# EAGLE schematic ads-b (EAGLE 7.5.0)
PROJECT_NAME: ADS-B Receiver; REVISION: 0.1

## Sheet 1 of 3
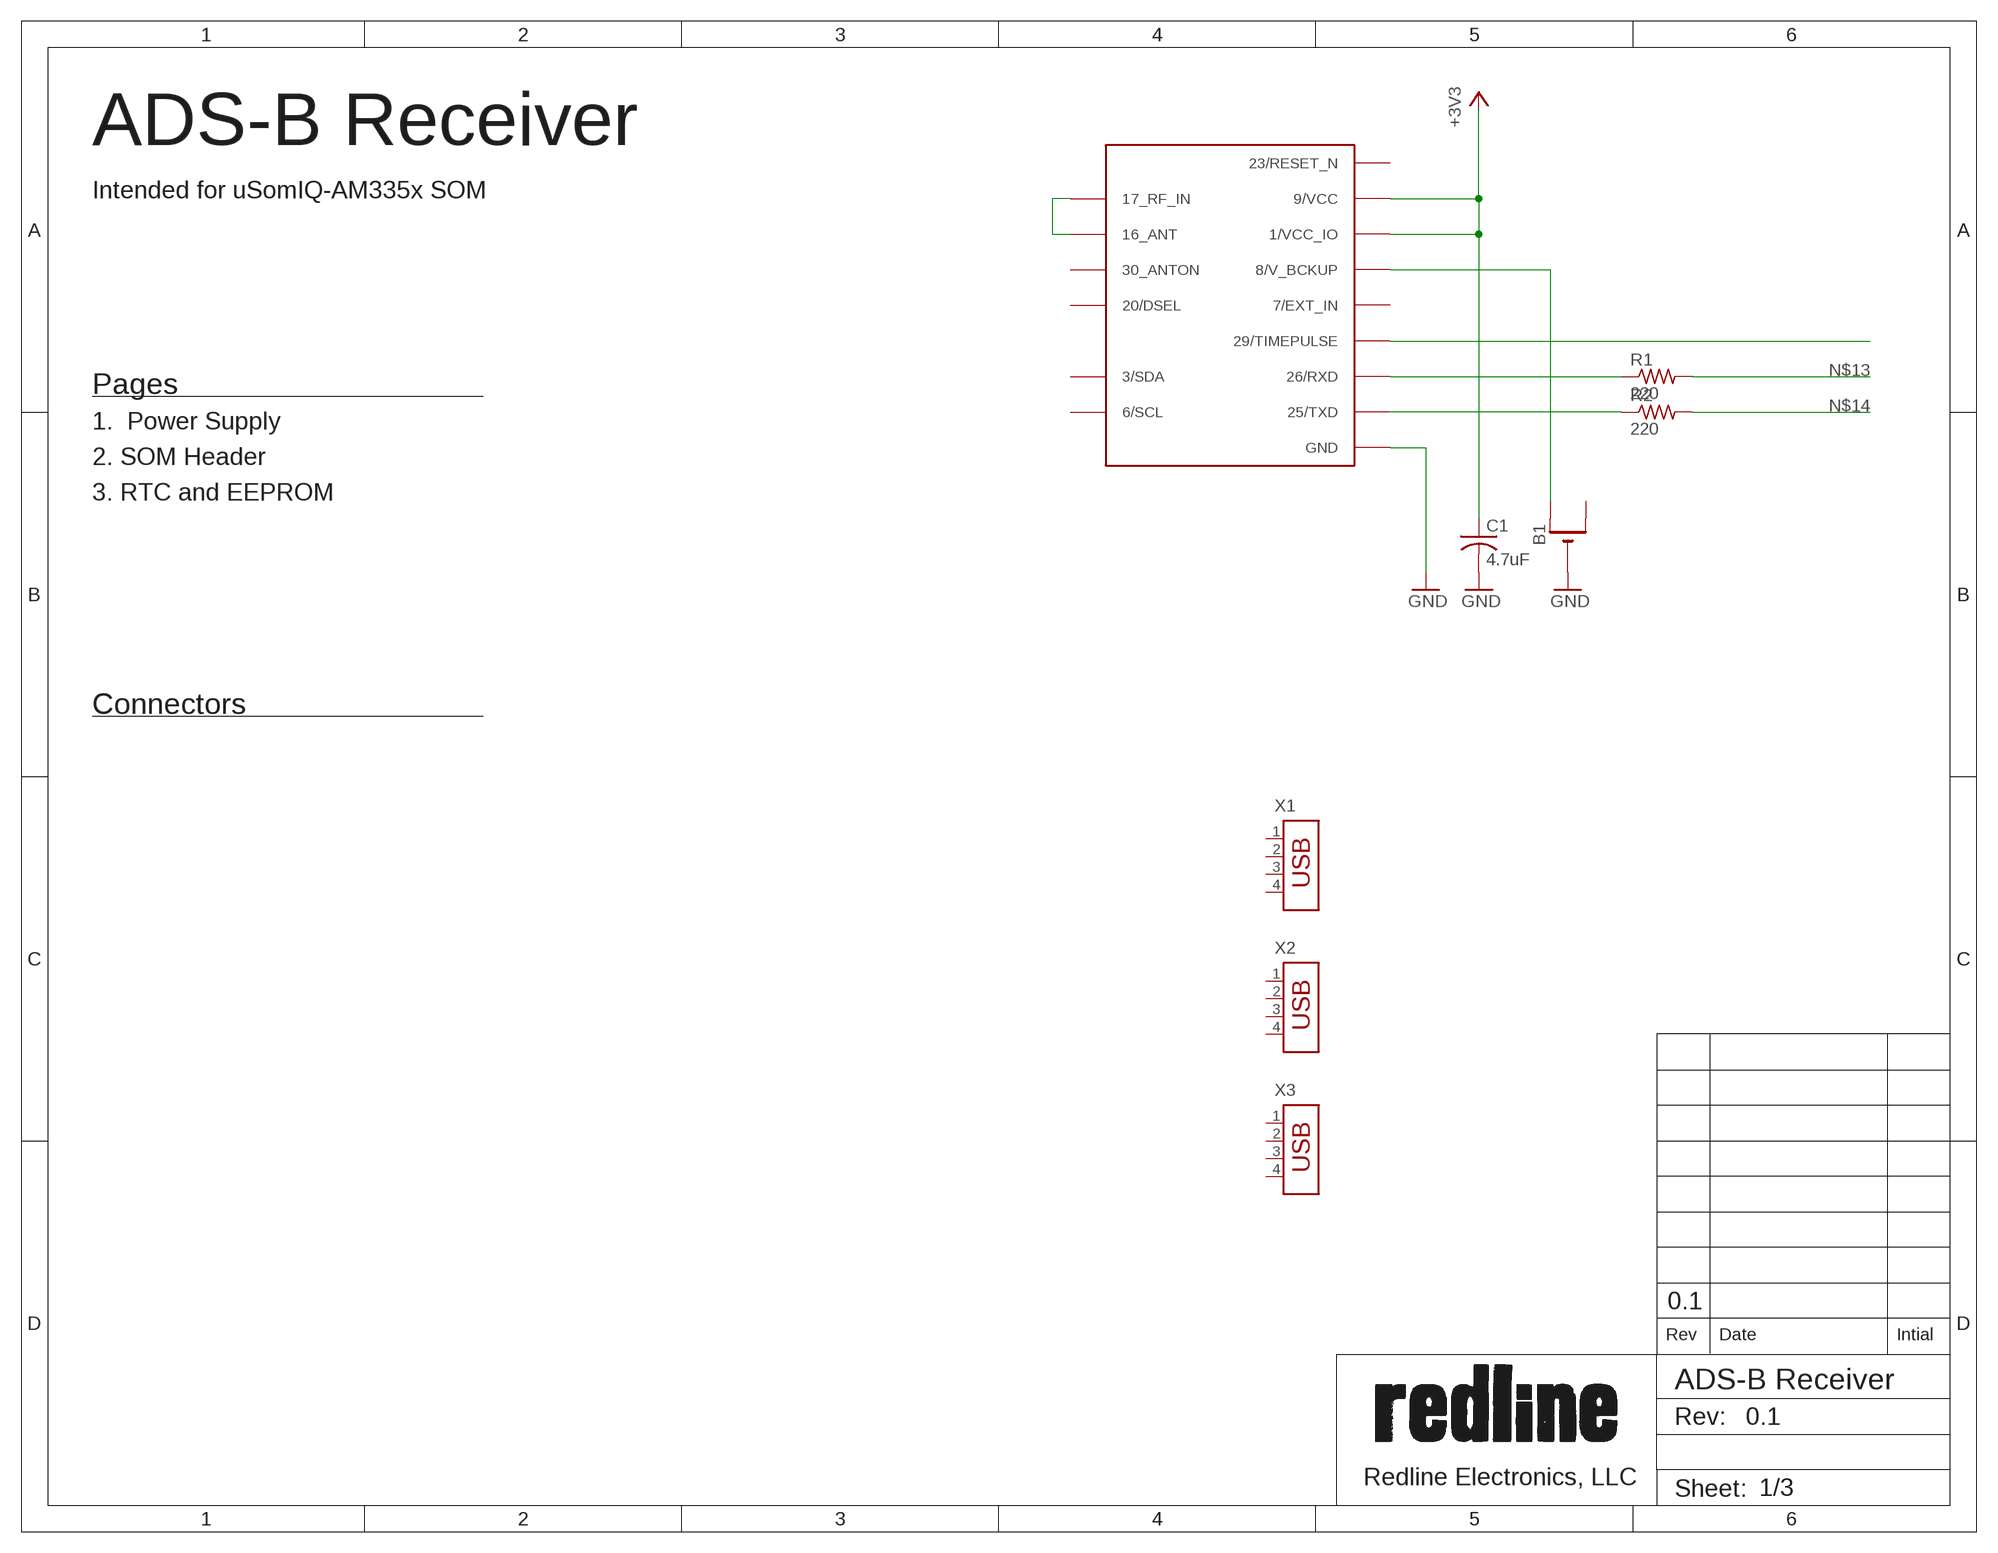
[diagram p0: schematic, sheet 1]

### Parts
B1  CR1220SMT  [CR1220-SMD]
C1  4.7uF  C-USC0603  [C0603]
R1  220  R-US_R0603  [R0603]
R2  220  R-US_R0603  [R0603]
U$1  UBLOX_CAM  [UBLOX_CAM]
X1  USB-787616  [USB]
X2  USB-787616  [USB]
X3  USB-787616  [USB]

### Nets
+3V3: C1.1 U$1.1/VCC_IO U$1.9/VCC ; also sheet 2
GND: B1.- C1.2 U$1.4/GND(GND) U$1.5/GND(GND) U$1.10/GND(GND) U$1.11/GND(GND) U$1.12/GND(GND) U$1.13/GND(GND) U$1.14/GND(GND) U$1.15/GND(GND) U$1.18/GND(GND) U$1.19/GND(GND) U$1.21/GND(GND) U$1.22/GND(GND) U$1.27/GND(GND) U$1.31/GND(GND) ; also sheet 2
N$1: B1.+$1(+) U$1.8/V_BCKP(8/V_BCKUP)
N$8: R1.1 U$1.26/RXD
N$12: R2.1 U$1.25/TXD
N$13: R1.2
N$14: R2.2
N$15: U$1.29/TIMEPULSE
N$26: U$1.16/ANT(16_ANT) U$1.17/RF_IN(17_RF_IN)
Unconnected: B1.+$2(+1) U$1.3/SDA U$1.6/SCL U$1.7/EXINT(7/EXT_IN) U$1.20/DSEL U$1.30/ANTON(30_ANTON) X1.1 X1.2 X1.3 X1.4 X2.1 X2.2 X2.3 X2.4 X3.1 X3.2 X3.3 X3.4

### Notes on the sheet
- ADS-B Receiver
- Intended for uSomIQ-AM335x SOM
- Pages
- 1.  Power Supply
- 2. SOM Header
- 3. RTC and EEPROM
- Connectors
- 0.1

## Sheet 2 of 3
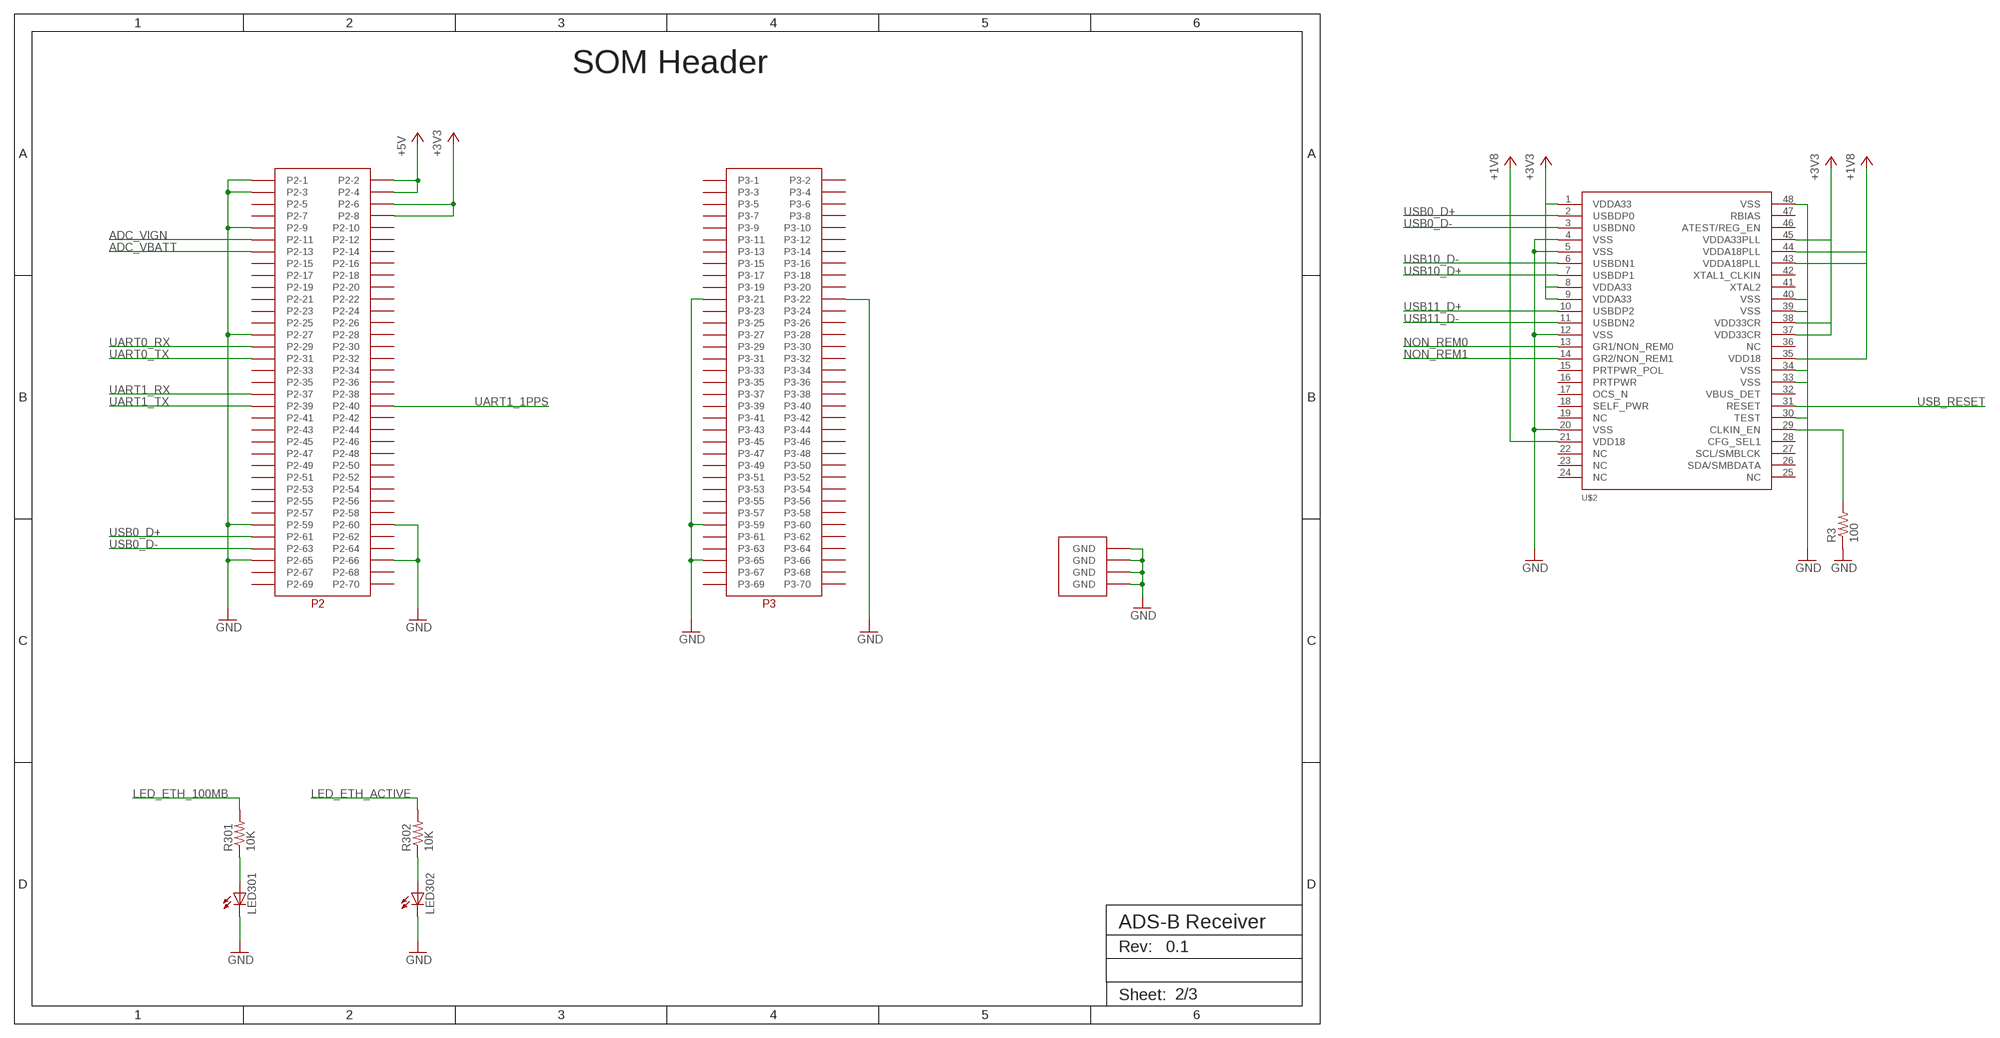
[diagram p1: schematic, sheet 2]

### Parts
LED301  LEDSML0603  [SML0603]
LED302  LEDSML0603  [SML0603]
P301  USOMIQ-AM335X  [USOMIQ-AM335X]
R3  100  R-US_R0603  [R0603]
R301  10K  R-US_R0603  [R0603]
R302  10K  R-US_R0603  [R0603]
U$2  USB2502  [S-PQFP-G48]

### Nets
+3V3: P301.P$6(P2-6) P301.P$8(P2-8) U$2.1(VDDA33) U$2.8(VDDA33) U$2.9(VDDA33) U$2.21(VDD18) U$2.35(VDD18) U$2.37(VDD33CR) U$2.38(VDD33CR) U$2.43(VDDA18PLL) U$2.44(VDDA18PLL) U$2.45(VDDA33PLL) ; supply symbol labelled +1V8 ; also sheet 1
+5V: P301.P$2(P2-2) P301.P$4(P2-4)
ADC_VBATT: P301.P$13(P2-13)
ADC_VIGN: P301.P$11(P2-11)
GND: LED301.C LED302.C P301.MOUNT@0(GND) P301.MOUNT@1(GND) P301.MOUNT@2(GND) P301.MOUNT@3(GND) P301.P$1(P2-1) P301.P$3(P2-3) P301.P$9(P2-9) P301.P$27(P2-27) P301.P$59(P2-59) P301.P$60(P2-60) P301.P$65(P2-65) P301.P$66(P2-66) P301.P$91(P3-21) P301.P$92(P3-22) P301.P$129(P3-59) P301.P$135(P3-65) R3.1 U$2.4(VSS) U$2.5(VSS) U$2.12(VSS) U$2.20(VSS) U$2.30(TEST) U$2.33(VSS) U$2.34(VSS) U$2.39(VSS) U$2.40(VSS) U$2.48(VSS) ; also sheet 1
LED_ETH_100MB: R301.2
LED_ETH_ACTIVE: R302.2
N$2: R3.2 U$2.29(CLKIN_EN)
NON_REM0: U$2.13(GR1/NON_REM0)
NON_REM1: U$2.14(GR2/NON_REM1)
UART0_RX: P301.P$29(P2-29)
UART0_TX: P301.P$31(P2-31)
UART1_1PPS: P301.P$40(P2-40)
UART1_RX: P301.P$37(P2-37)
UART1_TX: P301.P$39(P2-39)
USB0_D+: P301.P$61(P2-61) U$2.2(USBDP0)
USB0_D-: P301.P$63(P2-63) U$2.3(USBDN0)
USB10_D+: U$2.7(USBDP1)
USB10_D-: U$2.6(USBDN1)
USB11_D+: U$2.10(USBDP2)
USB11_D-: U$2.11(USBDN2)
USB_RESET: U$2.31(RESET)
VDD_PGOOD1: LED301.A R301.1
VDD_PGOOD2: LED302.A R302.1
Unconnected: P301.P$5(P2-5) P301.P$7(P2-7) P301.P$10(P2-10) P301.P$12(P2-12) P301.P$14(P2-14) P301.P$15(P2-15) P301.P$16(P2-16) P301.P$17(P2-17) P301.P$18(P2-18) P301.P$19(P2-19) P301.P$20(P2-20) P301.P$21(P2-21) P301.P$22(P2-22) P301.P$23(P2-23) P301.P$24(P2-24) P301.P$25(P2-25) P301.P$26(P2-26) P301.P$28(P2-28) P301.P$30(P2-30) P301.P$32(P2-32) P301.P$33(P2-33) P301.P$34(P2-34) P301.P$35(P2-35) P301.P$36(P2-36) P301.P$38(P2-38) P301.P$41(P2-41) P301.P$42(P2-42) P301.P$43(P2-43) P301.P$44(P2-44) P301.P$45(P2-45) P301.P$46(P2-46) P301.P$47(P2-47) P301.P$48(P2-48) P301.P$49(P2-49) P301.P$50(P2-50) P301.P$51(P2-51) P301.P$52(P2-52) P301.P$53(P2-53) P301.P$54(P2-54) P301.P$55(P2-55) P301.P$56(P2-56) P301.P$57(P2-57) P301.P$58(P2-58) P301.P$62(P2-62) P301.P$64(P2-64) P301.P$67(P2-67) P301.P$68(P2-68) P301.P$69(P2-69) P301.P$70(P2-70) P301.P$71(P3-1) P301.P$72(P3-2) P301.P$73(P3-3) P301.P$74(P3-4) P301.P$75(P3-5) P301.P$76(P3-6) P301.P$77(P3-7) P301.P$78(P3-8) P301.P$79(P3-9) P301.P$80(P3-10) P301.P$81(P3-11) P301.P$82(P3-12) P301.P$83(P3-13) P301.P$84(P3-14) P301.P$85(P3-15) P301.P$86(P3-16) P301.P$87(P3-17) P301.P$88(P3-18) P301.P$89(P3-19) P301.P$90(P3-20) P301.P$93(P3-23) P301.P$94(P3-24) P301.P$95(P3-25) P301.P$96(P3-26) P301.P$97(P3-27) P301.P$98(P3-28) P301.P$99(P3-29) P301.P$100(P3-30) P301.P$101(P3-31) P301.P$102(P3-32) P301.P$103(P3-33) P301.P$104(P3-34) P301.P$105(P3-35) P301.P$106(P3-36) P301.P$107(P3-37) P301.P$108(P3-38) P301.P$109(P3-39) P301.P$110(P3-40) P301.P$111(P3-41) P301.P$112(P3-42) P301.P$113(P3-43) P301.P$114(P3-44) P301.P$115(P3-45) P301.P$116(P3-46) P301.P$117(P3-47) P301.P$118(P3-48) P301.P$119(P3-49) P301.P$120(P3-50) P301.P$121(P3-51) P301.P$122(P3-52) P301.P$123(P3-53) P301.P$124(P3-54) P301.P$125(P3-55) P301.P$126(P3-56) P301.P$127(P3-57) P301.P$128(P3-58) P301.P$130(P3-60) P301.P$131(P3-61) P301.P$132(P3-62) P301.P$133(P3-63) P301.P$134(P3-64) P301.P$136(P3-66) P301.P$137(P3-67) P301.P$138(P3-68) P301.P$139(P3-69) P301.P$140(P3-70) U$2.15(PRTPWR_POL) U$2.16(PRTPWR) U$2.17(OCS_N) U$2.18(SELF_PWR) U$2.19(NC) U$2.22(NC) U$2.23(NC) U$2.24(NC) U$2.25(NC) U$2.26(SDA/SMBDATA) U$2.27(SCL/SMBLCK) U$2.28(CFG_SEL1) U$2.32(VBUS_DET) U$2.36(NC) U$2.41(XTAL2) U$2.42(XTAL1_CLKIN) U$2.46(ATEST/REG_EN) U$2.47(RBIAS)

### Notes on the sheet
- SOM Header

## Sheet 3 of 3
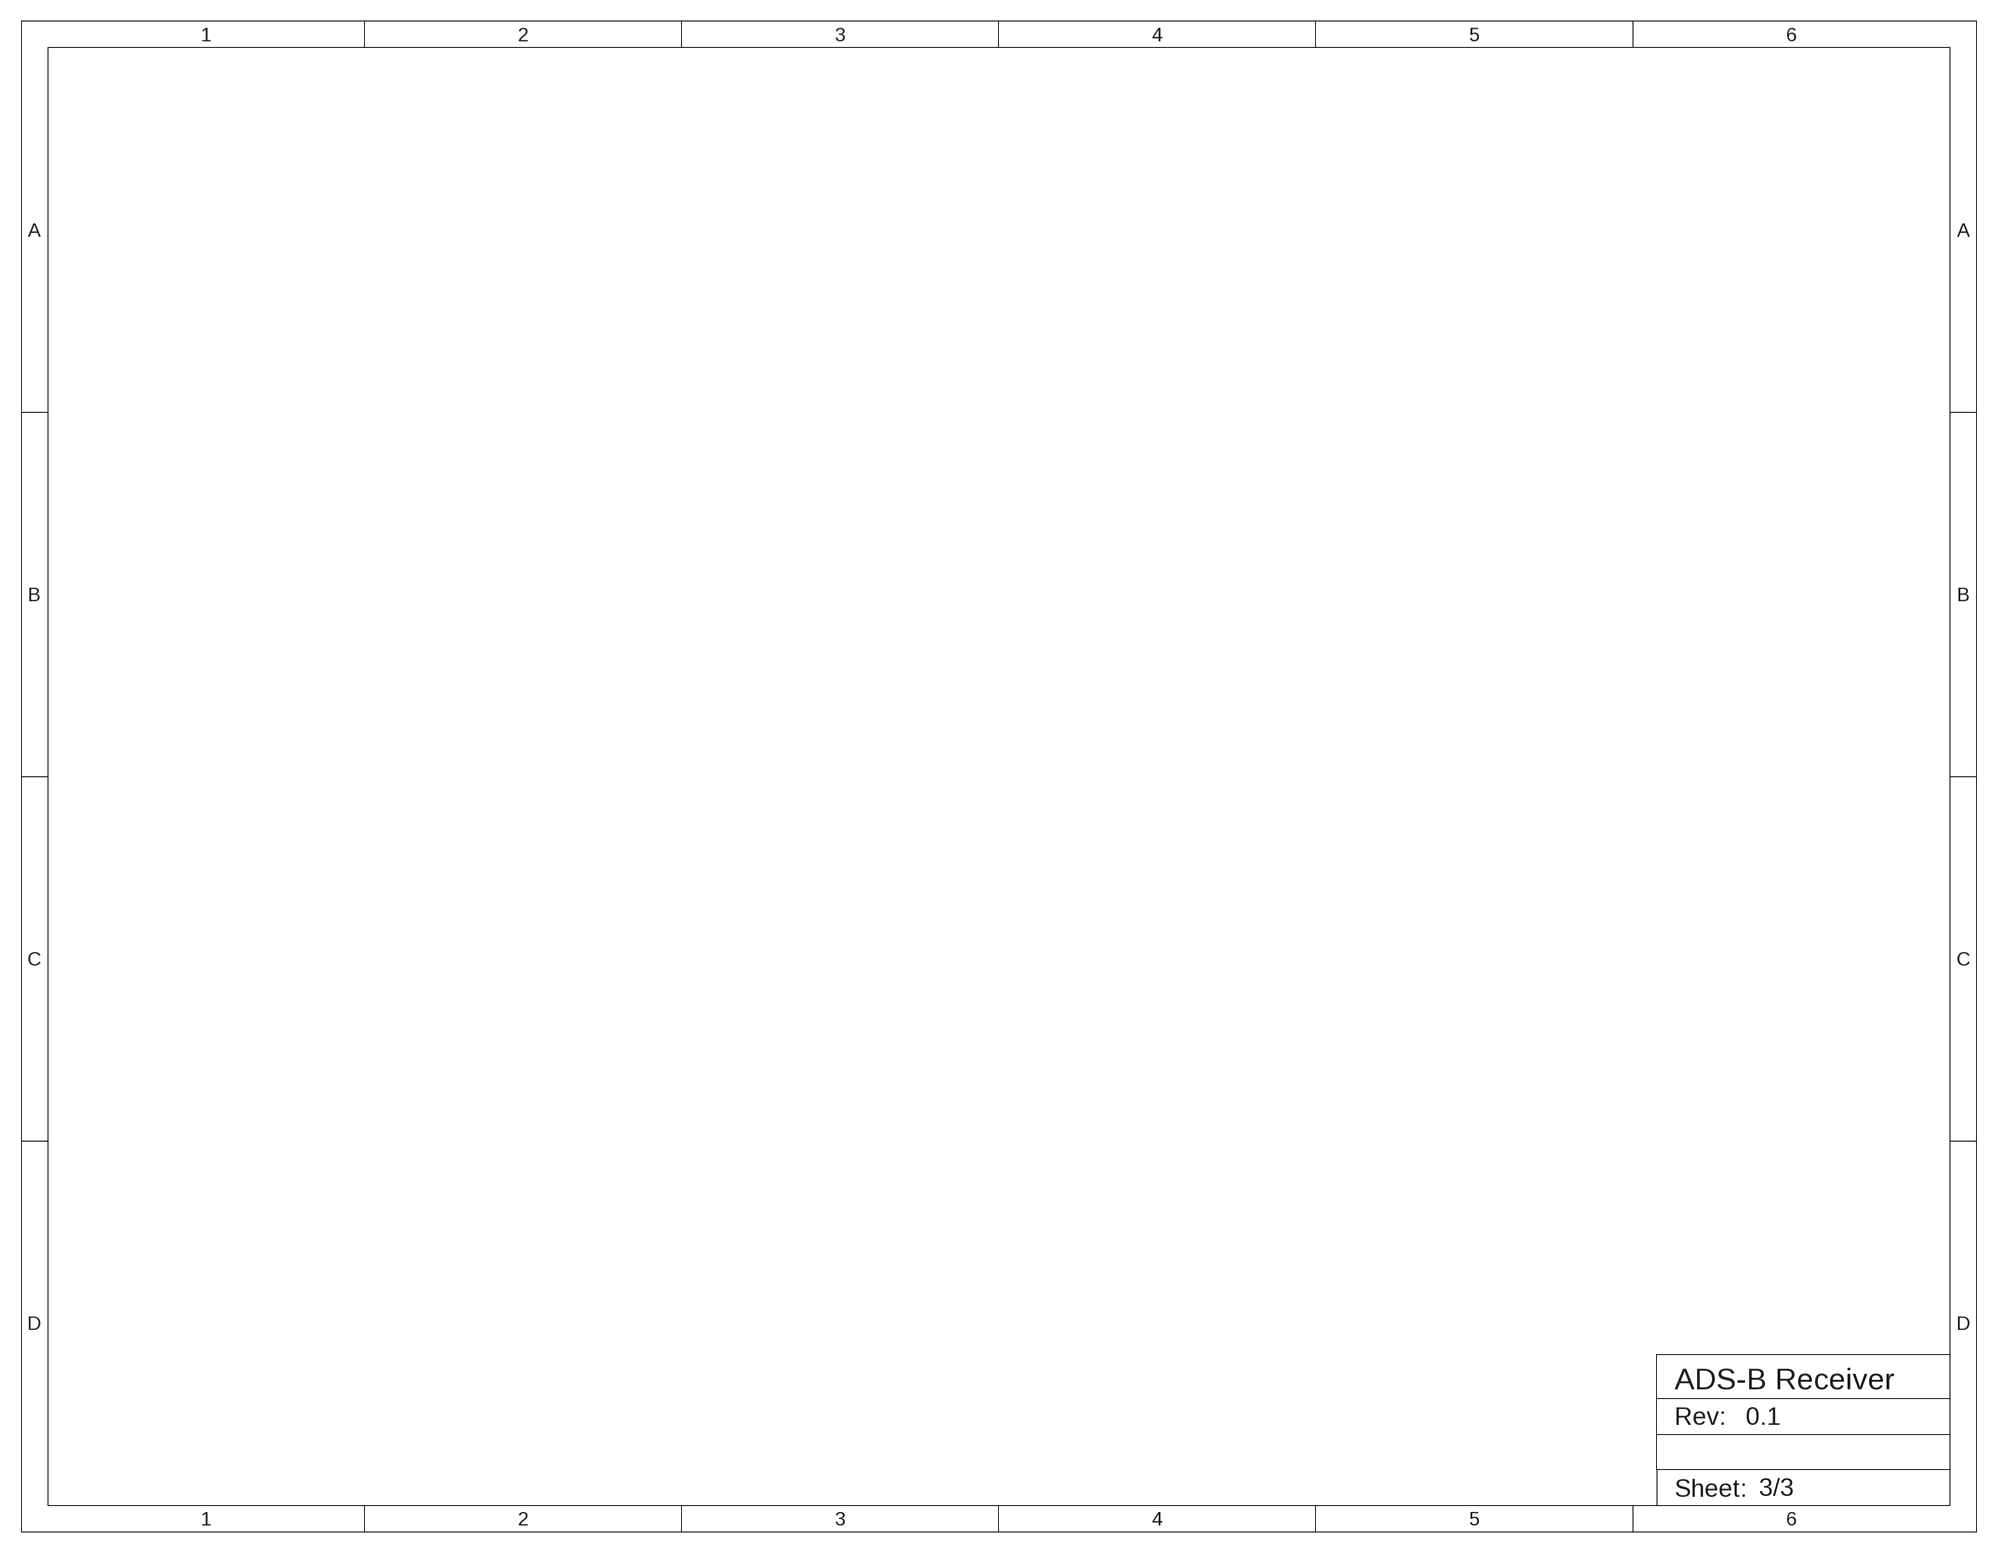
[diagram p2: schematic, sheet 3]

## Power pins joined to a net without a drawn wire
23/RESET_N: U$1.23/RESET_N

## Library data of the parts
B1 = adafruit:CR1220: CR1216/CR1220/CR1225 12mm 3V lithium coin cell Great for battery packup. Both SMT and THM holders. Note the THM package has the ground pads on both sides of the PCB so that the masks are the same - this reduces the cost
C1 = rcl:C-US: CAPACITOR, American symbol
LED301 LED302 = led:LED: LED OSRAM: - CHIPLED LG R971, LG N971, LY N971, LG Q971, LY Q971, LO R971, LY R971 LH N974, LH R974 LS Q976, LO Q976, LY Q976 LO Q996 - Hyper CHIPLED LW Q18S LB Q993, LB Q99A, LB R99A - SideLED LS A670, LO A670, LY A670, LG A670, LP A670 LB A673, LV A673, LT A673, LW A673 LH A674 LY A675 LS A676, LA A676, LO A676, LY A676, LW A676 LS A679, LY A679, LG A679 - Hyper Micro SIDELED® LS Y876, LA Y876, LO Y876, LY Y876 LT Y87S - SmartLED LW L88C, LW L88S LB L89C, LB L89S, LG L890 LS L89K, LO L89K, LY L89K LS L896, LA L896, LO L896, LY L896 - TOPLED LS T670, LO T670, LY T670, LG T670, LP T670 LSG T670, LSP T670, LSY T670, LOP T670, LYG T670 LG T671, LOG T671, LSG T671 LB T673, LV T673, LT T673, LW T673 LH T674 LS T676, LA T676, LO T676, LY T676, LB T676, LH T676, LSB T676, LW T676 LB T67C, LV T67C, LT T67C, LS T67K, LO T67K, LY T67K, LW E67C LS E67B, LA E67B, LO E67B, LY E67B, LB E67C, LV E67C, LT E67C LW T67C LS T679, LY T679, LG T679 LS T770, LO T770, LY T770, LG T770, LP T770 LB T773, LV T773, LT T773, LW T773 LH T774 LS E675, LA E675, LY E675, LS T675 LS T776, LA T776, LO T776, LY T776, LB T776 LHGB T686 LT T68C, LB T68C - Hyper Mini TOPLED® LB M676 - Mini TOPLED Santana® LG M470 LS M47K, LO M47K, LY M47K Source: http://www.osram.convergy.de LUXEON: - LUMILED® LXK2-PW12-R00, LXK2-PW12-S00, LXK2-PW14-U00, LXK2-PW14-V00 LXK2-PM12-R00, LXK2-PM12-S00, LXK2-PM14-U00 LXK2-PE12-Q00, LXK2-PE12-R00, LXK2-PE12-S00, LXK2-PE14-T00, LXK2-PE14-U00 LXK2-PB12-K00, LXK2-PB12-L00, LXK2-PB12-M00, LXK2-PB14-N00, LXK2-PB14-P00, LXK2-PB14-Q00 LXK2-PR12-L00, LXK2-PR12-M00, LXK2-PR14-Q00, LXK2-PR14-R00 LXK2-PD12-Q00, LXK2-PD12-R00, LXK2-PD12-S00 LXK2-PH12-R00, LXK2-PH12-S00 LXK2-PL12-P00, LXK2-PL12-Q00, LXK2-PL12-R00 Source: www.luxeon.com KINGBRIGHT: KA-3528ASYC Source: www.kingbright.com
P301 = connectors:USOMIQ-AM335X
R1-R3 R301 R302 = rcl:R-US_: RESISTOR, American symbol
U$1 = ubloxLib:UBLOX_CAM: u-blox CAM GNSS antenna module
U$2 = misc-ics:USB2502
X1-X3 = con-amp:USB-787616: AMP connector